# EAGLE design Telecomanda_Licenta (EAGLE 9.6.2)
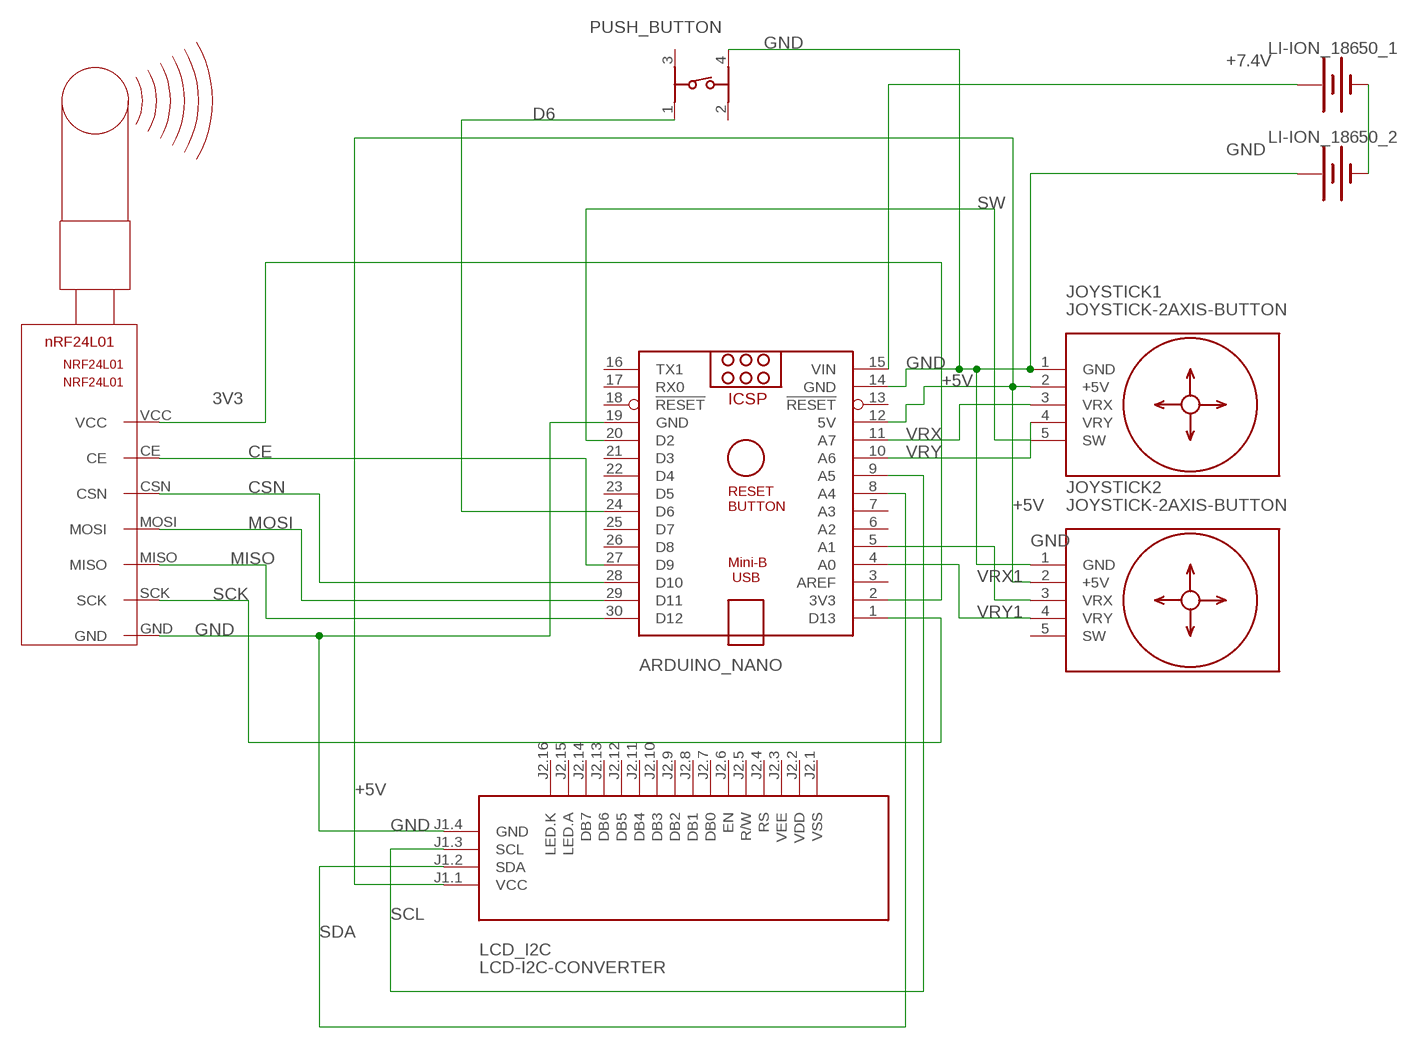
[diagram p0: schematic, sheet 1]

## Parts
ARDUINO_NANO  ARDUINO_NANO  [ARDUINO_NANO]
JOYSTICK1  JOYSTICK-2AXIS-BUTTON  [JOYSTICK-2AXIS-BUTTON]
JOYSTICK2  JOYSTICK-2AXIS-BUTTON  [JOYSTICK-2AXIS-BUTTON]
LCD_I2C  LCD-I2C-CONVERTER  [LCD-I2C-CONVERTER]
LI-ION_18650_1  BATTERY-18650  [BATTERY_18650-HOLDER]
LI-ION_18650_2  BATTERY-18650  [BATTERY_18650-HOLDER]
NRF24L01  NRF24L01  [NRF24L01]
PUSH_BUTTON  430152050836  [430152050836]

## Nets
3V3: ARDUINO_NANO.2(3V3) NRF24L01.VCC
+5V: ARDUINO_NANO.12(5V) JOYSTICK1.2(+5V) JOYSTICK2.2(+5V) LCD_I2C.J1.1(VCC)
+7.4V: ARDUINO_NANO.15(VIN) LI-ION_18650_1.PWR@1(+)
CE: ARDUINO_NANO.27(D9) NRF24L01.CE
CSN: ARDUINO_NANO.28(D10) NRF24L01.CSN
D6: ARDUINO_NANO.24(D6) PUSH_BUTTON.1
GND: ARDUINO_NANO.14(GND) ARDUINO_NANO.19(GND) JOYSTICK1.1(GND) JOYSTICK2.1(GND) LCD_I2C.J1.4(GND) LI-ION_18650_2.PWR@1(+) NRF24L01.GND PUSH_BUTTON.4
MISO: ARDUINO_NANO.30(D12) NRF24L01.MISO
MOSI: ARDUINO_NANO.29(D11) NRF24L01.MOSI
N$19: LI-ION_18650_1.GND@1(-) LI-ION_18650_2.GND@1(-)
SCK: ARDUINO_NANO.1(D13) NRF24L01.SCK
SCL: ARDUINO_NANO.9(A5) LCD_I2C.J1.3(SCL)
SDA: ARDUINO_NANO.8(A4) LCD_I2C.J1.2(SDA)
SW: ARDUINO_NANO.20(D2) JOYSTICK1.5(SW)
VRX: ARDUINO_NANO.11(A7) JOYSTICK1.3(VRX)
VRX1: ARDUINO_NANO.5(A1) JOYSTICK2.3(VRX)
VRY: ARDUINO_NANO.10(A6) JOYSTICK1.4(VRY)
VRY1: ARDUINO_NANO.4(A0) JOYSTICK2.4(VRY)
Unconnected: ARDUINO_NANO.3(AREF) ARDUINO_NANO.6(A2) ARDUINO_NANO.7(A3) ARDUINO_NANO.13(!RESET) ARDUINO_NANO.16(TX1) ARDUINO_NANO.17(RX0) ARDUINO_NANO.18(!RESET) ARDUINO_NANO.21(D3) ARDUINO_NANO.22(D4) ARDUINO_NANO.23(D5) ARDUINO_NANO.25(D7) ARDUINO_NANO.26(D8) JOYSTICK2.5(SW) LCD_I2C.J2.1(VSS) LCD_I2C.J2.2(VDD) LCD_I2C.J2.3(VEE) LCD_I2C.J2.4(RS) LCD_I2C.J2.5(R/W) LCD_I2C.J2.6(EN) LCD_I2C.J2.7(DB0) LCD_I2C.J2.8(DB1) LCD_I2C.J2.9(DB2) LCD_I2C.J2.10(DB3) LCD_I2C.J2.11(DB4) LCD_I2C.J2.12(DB5) LCD_I2C.J2.13(DB6) LCD_I2C.J2.14(DB7) LCD_I2C.J2.15(LED.A) LCD_I2C.J2.16(LED.K) PUSH_BUTTON.2 PUSH_BUTTON.3

## Library data of the parts
ARDUINO_NANO = ArduinoNanoV30:ARDUINO_NANO: Arduino Nano V3.0 Overview: The Arduino Nano is a small, complete, and breadboard-friendly board based on the ATmega328 (Arduino Nano 3.x) or ATmega168 (Arduino Nano 2.x). It has more or less the same functionality of the Arduino Duemilanove, but in a different package. It lacks only a DC power jack, and works with a Mini-B USB cable instead of a standard one. The Nano was designed and is being produced by Gravitech. Specifications: Microcontroller Atmel ATmega168 or ATmega328 Operating Voltage (logic level) 5 V Input Voltage (recommended) 7-12 V Input Voltage (limits) 6-20 V Digital I/O Pins 14 (of which 6 provide PWM output) Analog Input Pins 8 DC Current per I/O Pin 40 mA Flash Memory 16 KB (ATmega168) or 32 KB (ATmega328) of which 2 KB used by bootloader SRAM 1 KB (ATmega168) or 2 KB (ATmega328) EEPROM 512 bytes (ATmega168) or 1 KB (ATmega328) Clock Speed 16 MHz Dimensions 0.73" x 1.70" Length 45 mm Width 18 mm Weigth 5 g Power: The Arduino Nano can be powered via the Mini-B USB connection, 6-20V unregulated external power supply (pin 30), or 5V regulated external power supply (pin 27). The power source is automatically selected to the highest voltage source. Memory: The ATmega168 has 16 KB of flash memory for storing code (of which 2 KB is used for the bootloader); the ATmega328 has 32 KB, (also with 2 KB used for the bootloader). The ATmega168 has 1 KB of SRAM and 512 bytes of EEPROM (which can be read and written with the EEPROM library); the ATmega328 has 2 KB of SRAM and 1 KB of EEPROM. Input and Output: Each of the 14 digital pins on the Nano can be used as an input or output, using pinMode(), digitalWrite(), and digitalRead() functions. They operate at 5 volts. Each pin can provide or receive a maximum of 40 mA and has an internal pull-up resistor (disconnected by default) of 20-50 kOhms. In addition, some pins have specialized functions. Visit Arduino - ArduinoBoardNano <https://www.arduino.cc/en/Main/ArduinoBoardNano>
JOYSTICK1 JOYSTICK2 = diy-modules (3):JOYSTICK-2AXIS-BUTTON: 2-Axis Analog Joystick with Push Button Tutorial is available here: http://henrysbench.capnfatz.com/henrys-bench/arduino-sensors-and-input/arduino-ps2-joystick-tutorial-keyes-ky-023-deek-robot/ Click here to find device on ebay.com <http://www.ebay.com/sch/joystick+ps2+module>
LCD_I2C = diy-modules (3):LCD-I2C-CONVERTER: I2C Bus to 4-Bit Parallel LCD Interface with LED backlight driver
LI-ION_18650_1 LI-ION_18650_2 = SparkFun-Batteries:BATTERY: Battery - Single Cell A variety of battery chemistries, sizes, and footprints. Device List: 20MM_PTH - Coin Cell Battery Holder - 20mm (PTH) <https://www.sparkfun.com/products/783> 6.8MM_PTH - Coin Cell Battery Holder - 6.8MM(SMD) <https://www.digikey.com/product-detail/en/seiko-instruments/MS621FE-FL11E/728-1057-ND/1889208?WT.srch=1&gclid=CNOQ5a6LzdQCFZS2wAodXCkE0g> 12MM_SMD - Coin Cell Battery Holder - 12mm (SMD) <https://www.sparkfun.com/products/10592> 12MM_PTH - Coin Cell Battery Holder - 12mm (PTH) <https://www.sparkfun.com/products/7948> 20MM_SMD - 20mm Coin Cell Battery Holder (SMD) (2 legs) Used on the Big Time Watch Kit <https://www.sparkfun.com/products/11734> 20MM_SMD_4LEGS - Coin Cell Battery Holder - 20mm (SMD) <https://www.sparkfun.com/products/11892> 20MM_SMD_4LEGS_OVERPASTE - Coin Cell Battery Holder - 20mm (SMD) <https://www.sparkfun.com/products/11892> (Over-paste on the legs) 24.5MM_PTH - Coin Cell Battery Holder - 24.5mm (PTH) <https://www.sparkfun.com/products/8863> 9V - 9V Battery Holder - PC Mount Used on the SparkFun SparkPunk Sound Kit <https://www.sparkfun.com/products/11177> and SparkFun SparkPunk Sequencer Kit <https://www.sparkfun.com/products/12707> 18650 - Battery Holder - 18650 (PTH) <https://www.sparkfun.com/products/13113> AA - Battery Holder - 1xAA (PTH) <https://www.sparkfun.com/products/7949> AAA - Battery Holder - 1xAAA (PTH) <https://www.sparkfun.com/products/12718> AA_KIT - Battery Holder - 1xAA (PTH) <https://www.sparkfun.com/products/7949> Special kit package - pads only have exposed copper on one side of the board. AAA_KIT - Battery Holder - 1xAAA (PTH) <https://www.sparkfun.com/products/12718> Special kit package - pads only have exposed copper on one side of the board.; PROD_ID: BATT-12327; SF_SKU: PRT-13113
NRF24L01 = Clean-Kong (1):NRF24L01: nrF54L01 2.4GHz with 100 Channels Emitter/Reveiver SPI Controlled Roboshop / Minint
PUSH_BUTTON = Wurth_Switch_WS-TASV:430152050836: WS-TASV SMT Tact Switch 6x6 mm Material Properties Cover Material : Stainless Steel Properties Actuator Material:LCP Actuator Flammability :UL94 V-0 Rating Actuator Color:Black; Salmon; White Frame Material:LCP Flammability Rating:UL94 V-0 Frame Color:Black Contact Material:Stainless Steel Contact Plating:Silver Terminal Material:Copper Alloy Terminal Plating:Silver VR:12 V (DC) Contact Resistance Initial:100 mΩ Contact Resistance After Life Test:2Ω RISO:100 MΩ Withstanding Voltage:250 V (AC) Washable:No Qty.:4000;5000 Mechanical Properties Electrical Life:400; 550; 1000 Stroke :0.25 mm General Information Operating Temperature:-40 up to +85 °C Washable:No Packaging Properties Packaging:Tape and Reel <https://www.we-online.com/catalog/media/o37470v209%20Family_WS-TASV_6x6mm_SMD_Tact_Switch_4301820xx8xx.jpg> Details see: https://www.we-online.com/catalog/en/TASV_6X6_SMD/ Updated by yingchun,Shan;2020-02-18 2020(C) Würth Elektronik; DATASHEET-URL: https://www.we-online.com/catalog/datasheet/430152050836.pdf; H: 5mm; OPERATION-FORCE: 360g; PART-NUMBER: 430152050836; QTY: 1000

## Board
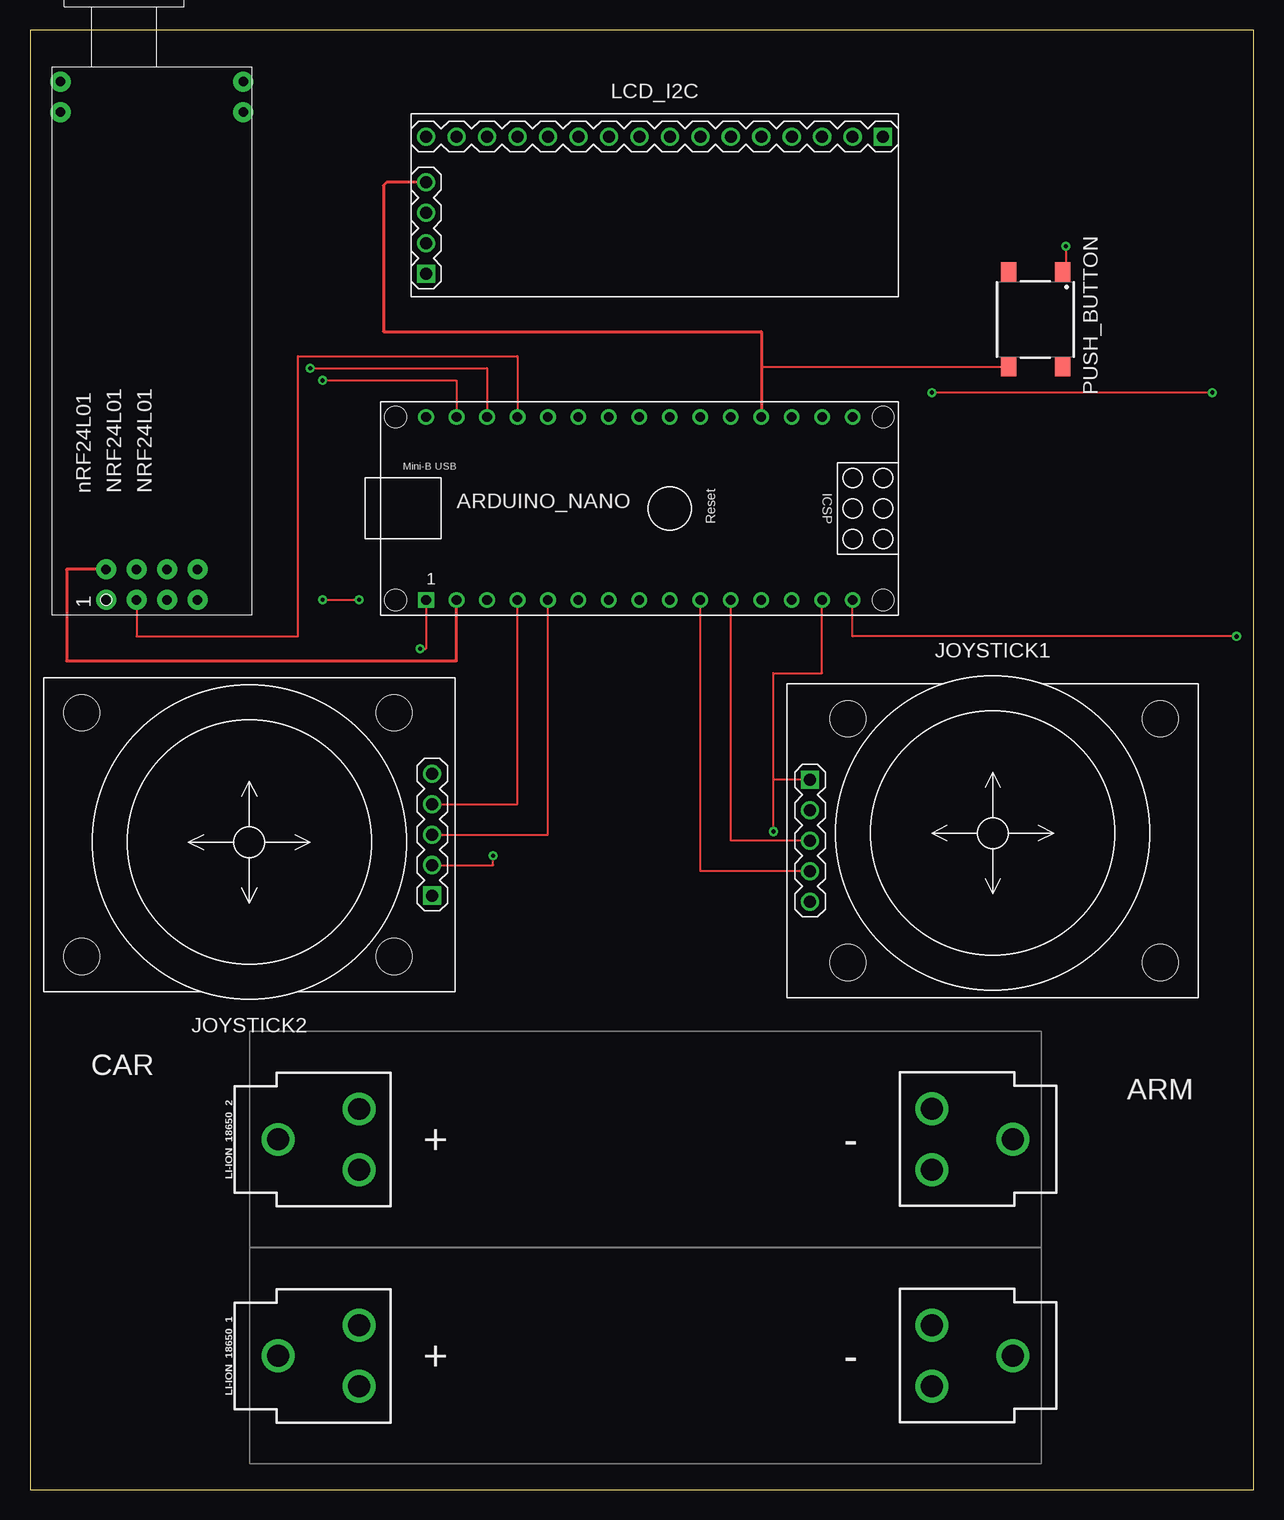
[diagram p1: board, top side]
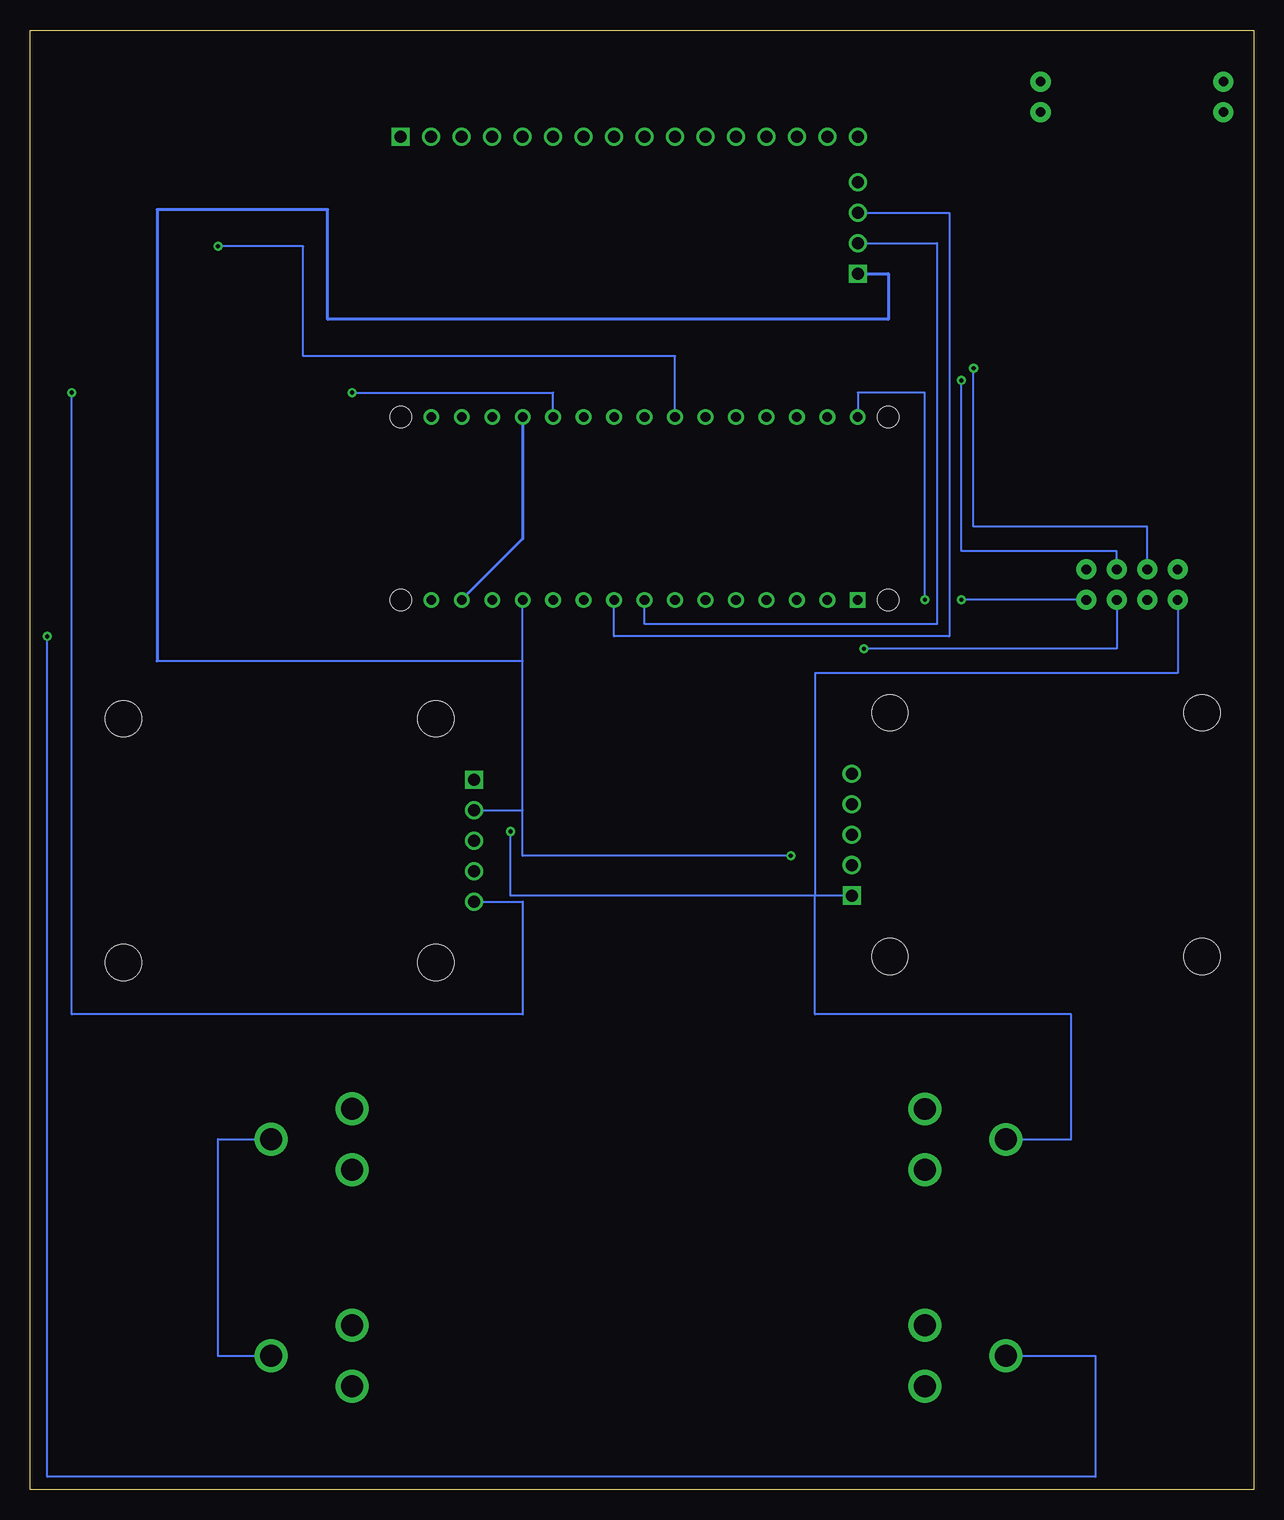
[diagram p2: board, bottom side, seen from below]

Size 102.03 x 121.66 mm. Coordinates in mm from the lower left corner, seen from the top.
Outline: 0,0 102.03,0 102.03,121.66 0,121.66 0,0
Copper layers (1*16): Top 0.035mm / dielectric 1.5mm / Bottom 0.035mm
Design rules "default": minimum track width 6mil, minimum drill 0.35mm, track to track 6mil, track to pad 6mil, pad to pad 6mil, via to via 6mil, smd to smd 6mil, copper to edge 40mil, drill to drill 6mil, minimum pad ring 10mil, minimum via ring 8mil, stop-mask expansion 4mil, vias tented up to drill 0mil, thermal gap 10mil

### Footprints (pad centres in the part's own frame; a part is rotated, then mirrored left to right if it is on the bottom)
ARDUINO_NANO = drill 0.8 square: 1 -20.32,-7.62 | drill 0.8: 2 -17.78,-7.62; 3 -15.24,-7.62; 4 -12.7,-7.62; 5 -10.16,-7.62; 6 -7.62,-7.62; 7 -5.08,-7.62; 8 -2.54,-7.62; 9 0,-7.62; 10 2.54,-7.62; 11 5.08,-7.62; 12 7.62,-7.62; 13 10.16,-7.62; 14 12.7,-7.62; 15 15.24,-7.62; 16 15.24,7.62; 17 12.7,7.62; 18 10.16,7.62; 19 7.62,7.62; 20 5.08,7.62; 21 2.54,7.62; 22 0,7.62; 23 -2.54,7.62; 24 -5.08,7.62; 25 -7.62,7.62; 26 -10.16,7.62; 27 -12.7,7.62; 28 -15.24,7.62; 29 -17.78,7.62; 30 -20.32,7.62 | hole 1.778: -22.86,-7.62; -22.86,7.62; 17.78,7.62; 17.78,-7.62
JOYSTICK-2AXIS-BUTTON = drill 1 square: 1 -15.24,5.08 | drill 1: 2 -15.24,2.54; 3 -15.24,0; 4 -15.24,-2.54; 5 -15.24,-5.08 | hole 3: -12.065,10.16; -12.065,-10.16; 13.97,-10.16; 13.97,10.16
LCD-I2C-CONVERTER = drill 1 square: J1.1 -19.05,-5.08; J2.1 19.05,6.35 | drill 1: J1.2 -19.05,-2.54; J1.3 -19.05,0; J1.4 -19.05,2.54; J2.2 16.51,6.35; J2.3 13.97,6.35; J2.4 11.43,6.35; J2.5 8.89,6.35; J2.6 6.35,6.35; J2.7 3.81,6.35; J2.8 1.27,6.35; J2.9 -1.27,6.35; J2.10 -3.81,6.35; J2.11 -6.35,6.35; J2.12 -8.89,6.35; J2.13 -11.43,6.35; J2.14 -13.97,6.35; J2.15 -16.51,6.35; J2.16 -19.05,6.35
BATTERY_18650-HOLDER = drill 1.829: GND@1 30.628,0.01; GND@2 23.88,2.55; GND@3 23.88,-2.53; PWR@1 -30.628,-0.01; PWR@2 -23.88,2.53; PWR@3 -23.88,-2.55
NRF24L01 = drill 0.8 pad 1.676: CE 0,-2.54; CSN 2.54,-2.54; GND 0,0; MISO 0,-7.62; MOSI 2.54,-5.08; P$1 40.64,-11.43; P$2 43.18,-11.43; P$3 43.18,3.81; P$4 40.64,3.81; P$8 2.54,-7.62; SCK 0,-5.08; VCC 2.54,0
430152050836 = smd 1.55 x 1.3: 1 -3.975,2.25; 2 -3.975,-2.25; 3 3.975,2.25; 4 3.975,-2.25

### Placement (x,y rotation side)
ARDUINO_NANO  53.34,81.79 0 top
JOYSTICK1  80.26,54.1 0 top
JOYSTICK2  18.29,54.61 180 top
LCD_I2C  52.07,106.43 0 top
LI-ION_18650_1  51.31,11.18 0 top
LI-ION_18650_2  51.31,29.21 0 top
NRF24L01  6.35,74.17 90 top
PUSH_BUTTON  83.82,97.54 270 top

### Tracks (layer width: path | path; a pad name or v marks a point on that pad's centre or on a via)
3V3
  Top 0.254: NRF24L01.VCC 3.05,76.71 3.05,69.09 35.56,69.09 ARDUINO_NANO.2
+5V  (via drill 0.35)
  Top 0.152: JOYSTICK2.2 38.61,52.07 v38.61,52.83
  Bottom 0.152: 91.44,69.09 60.96,69.09 | 60.96,69.09 ARDUINO_NANO.12 | JOYSTICK1.2 60.96,56.64 | 60.96,56.64 60.96,69.09 | 60.96,56.64 60.96,52.83 v38.61,52.83
  Bottom 0.254: LCD_I2C.J1.1 30.48,101.35 30.48,97.54 77.22,97.54 77.22,106.68 91.44,106.68 91.44,69.09
+7.4V  (via drill 0.35)
  Top 0.152: v100.58,71.12 68.58,71.12 ARDUINO_NANO.15
  Bottom 0.152: LI-ION_18650_1.PWR@1 13.21,11.17 13.21,1.09 100.58,1.09 v100.58,71.12
CE
  Top 0.152: NRF24L01.CE 8.89,71.12 22.35,71.12 22.35,94.49 40.64,94.49 ARDUINO_NANO.27
CSN  (via drill 0.35)
  Top 0.152: v23.37,93.47 38.1,93.47 ARDUINO_NANO.28
  Bottom 0.152: NRF24L01.CSN 8.89,80.26 23.37,80.26 v23.37,93.47
D6  (via drill 0.35)
  Top 0.152: v86.36,103.63 86.36,101.8 PUSH_BUTTON.1
  Bottom 0.152: ARDUINO_NANO.24 48.26,94.49 79.25,94.49 79.25,103.63 v86.36,103.63
GND  (via drill 0.35)
  Top 0.152: PUSH_BUTTON.4 60.96,93.56 ARDUINO_NANO.19 | JOYSTICK1.1 61.98,59.18 | 61.98,59.18 61.98,68.07 66.04,68.07 ARDUINO_NANO.14 | v61.98,54.86 61.98,59.18
  Top 0.254: LCD_I2C.J1.4 29.72,108.97 29.46,108.71 29.46,96.52 60.96,96.52 ARDUINO_NANO.19
  Bottom 0.152: LI-ION_18650_2.PWR@1 15.24,29.2 15.24,39.62 36.58,39.62 36.58,49.53 | NRF24L01.GND 6.35,68.07 36.58,68.07 36.58,49.53 | JOYSTICK2.1 36.58,49.53 | 36.58,49.53 61.98,49.53 v61.98,54.86
  Bottom 0.254: ARDUINO_NANO.14 60.96,79.25 ARDUINO_NANO.19
MISO  (via drill 0.35)
  Top 0.152: v24.38,74.17 v27.43,74.17
  Bottom 0.152: NRF24L01.MISO v24.38,74.17 | v27.43,74.17 27.43,91.44 33.02,91.44 ARDUINO_NANO.30
MOSI  (via drill 0.35)
  Top 0.152: ARDUINO_NANO.29 35.56,92.46 v24.38,92.46
  Bottom 0.152: NRF24L01.MOSI 11.43,78.23 24.38,78.23 v24.38,92.46
N$19
  Bottom 0.152: LI-ION_18650_1.GND@1 81.95,11.18 86.36,11.18 86.36,29.22 LI-ION_18650_2.GND@1
SCK  (via drill 0.35)
  Top 0.152: ARDUINO_NANO.1 33.02,70.1 v32.51,70.1
  Bottom 0.152: NRF24L01.SCK 11.43,70.1 v32.51,70.1
SCL
  Bottom 0.152: LCD_I2C.J1.3 25.4,106.43 25.4,71.12 53.34,71.12 ARDUINO_NANO.9
SDA
  Bottom 0.152: LCD_I2C.J1.2 26.42,103.89 26.42,72.14 50.8,72.14 ARDUINO_NANO.8
SW  (via drill 0.35)
  Top 0.152: v98.55,91.44 v75.18,91.44
  Bottom 0.152: JOYSTICK1.5 60.96,49.02 60.96,39.62 98.55,39.62 v98.55,91.44 | v75.18,91.44 58.42,91.44 ARDUINO_NANO.20
VRX
  Top 0.152: JOYSTICK1.3 58.42,54.1 ARDUINO_NANO.11
VRX1
  Top 0.152: JOYSTICK2.3 43.18,54.61 ARDUINO_NANO.5
VRY
  Top 0.152: JOYSTICK1.4 55.88,51.56 ARDUINO_NANO.10
VRY1
  Top 0.152: JOYSTICK2.4 40.64,57.15 ARDUINO_NANO.4

### Text on the board
tPlace: CAR | ARM